# EAGLE schematic LM386-audio-amp (EAGLE 5.07)
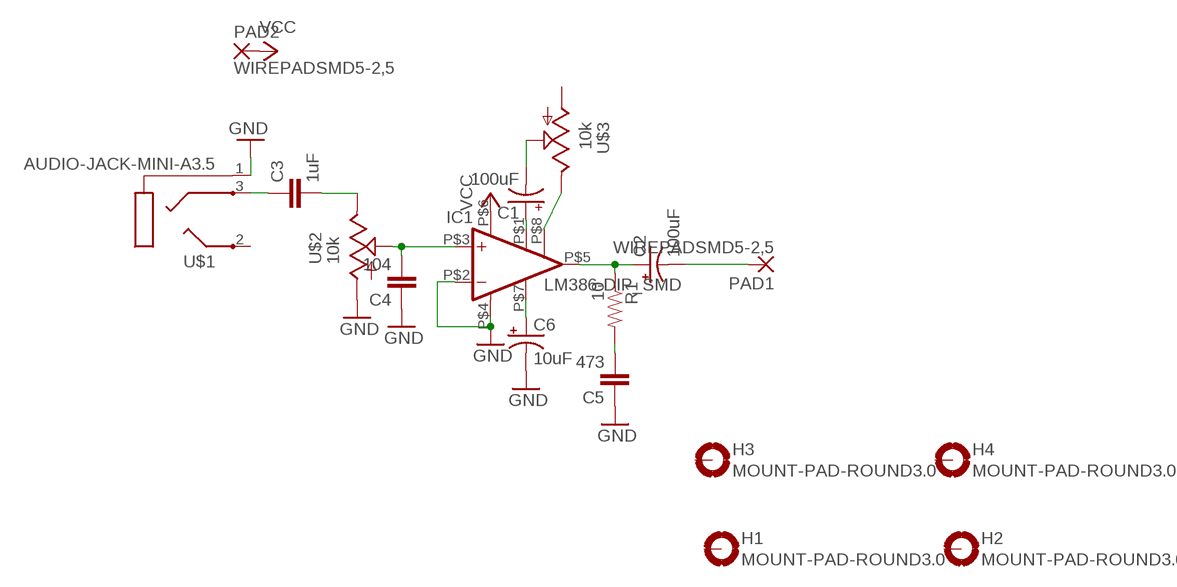
[diagram p0: schematic, sheet 1]

## Parts
C1  100uF  CAP_POL7343  [EIA7343]
C2  100uF  CAP_POL7343  [EIA7343]
C3  1uF  CAP-C0805  [C0805]
C4  104  CAP-C0805  [C0805]
C5  473  CAP-C0805  [C0805]
C6  10uF  CAP_POL7343  [EIA7343]
H1  MOUNT-PAD-ROUND3.0  [3,0-PAD]
H2  MOUNT-PAD-ROUND3.0  [3,0-PAD]
H3  MOUNT-PAD-ROUND3.0  [3,0-PAD]
H4  MOUNT-PAD-ROUND3.0  [3,0-PAD]
IC1  LM386-DIP_SMD  [DIP8-RF]
PAD1  WIREPADSMD5-2,5  [5-2,5]
PAD2  WIREPADSMD5-2,5  [5-2,5]
R1  10  RESISTOR0805  [0805]
U$1  AUDIO-JACK-MINI-A3.5  [MIN-AUDIO-3.5MM]
U$2  10k  POTSMD_BW  [POT_SMD_BLUE_WHITE]
U$3  10k  POTSMD_BW  [POT_SMD_BLUE_WHITE]

## Nets
GND: C4.1 C5.1 C6.C(-) IC1.P$2(-IN) IC1.P$4(GND) U$1.1(EARTH) U$2.A
N$1: C3.1 U$1.3(RING)
N$2: C3.2 U$2.E
N$3: C4.2 IC1.P$3(+IN) U$2.S
N$4: C6.A(+) IC1.P$7(BYPASS)
N$6: C2.A(+) IC1.P$5(OUT) R1.1
N$7: C5.2 R1.2
N$8: C2.C(-) PAD1.1(P)
N$9: C1.A(+) IC1.P$1(GAIN)
N$10: C1.C(-) U$3.S
N$11: IC1.P$8(GAIN) U$3.E
VCC: IC1.P$6(VS) PAD2.1(P)
Unconnected: H1.B3,0(MOUNT) H2.B3,0(MOUNT) H3.B3,0(MOUNT) H4.B3,0(MOUNT) U$1.2(TIP) U$3.A

## Library data of the parts
C1 C2 C6 = digital-toy:CAP_POL: Capacitor Polarized These are standard SMD and PTH capacitors. Normally 10uF, 47uF, and 100uF in electrolytic and tantalum varieties. Always verify the external diameter of the through hole cap, it varies with capacity, voltage, and manufacturer. The EIA devices should be standard. PANASONIC_D size: 6.5mmx6.5mmx5.5mm, 100uf (taobao:6.3mmx5.5mm), same as CVL0605 153cvl0405 size: 4mmx4mmx5.5mm, 10uf (taobao:4mmx5.5mm) ct6032 typical 47uF Tantalum, comment by hyl.
C3-C5 = digital-toy:CAP: Capacitor Standard 0603 ceramic capacitor, and 0.1" leaded capacitor.
H1-H4 = holes:MOUNT-PAD-ROUND: MOUNTING PAD, round
IC1 = digital-toy:LM386
PAD1 PAD2 = wirepad:WIREPAD: Wire PAD connect wire on PCB
R1 = digital-toy:RESISTOR: Resistor Basic schematic elements and footprints for 0603, 1206, and PTH 1/10th watt (small) resistors. digital-toy copy vertical mount of axial-0.3 from rcl.lbr : the 0207/xx
U$1 = digital-toy:AUDIO-JACK: 2.5 Stereo Audio Jack (SMT)
U$2 U$3 = digital-toy:POT: POT digital toy POT, 3296 multi turn, blue-white ... hyl 8/07/2001